# Altium schematic sheet nufsr-controller.schdoc: NUSense
size A4; Organization: Elby Designs; Address1: 9 Follan Close; Address2: Kariong; Address3: NSW 2250; Address4: Australia; Revision: 1; SheetNumber: 2; SheetTotal: 15; DrawnBy: Controller Section; Engineer: Laurie Biddulph; PageSetup: Record=PageOptions|CenterHorizontal=True|CenterVertical=True|PrintScale=1.38|XCorrection=1.00|YCorrection=1.00|PrintKind=1|BorderSize=5000000|LeftOffset=0|BottomOffset=0|Orientation=2|PaperLength=1000|PaperWidth=1000|Scale=100|PaperSource=7|PrintQuality=-4|MediaType=1|DitherType=10|PaperKind=A3|PrintScaleMode=1
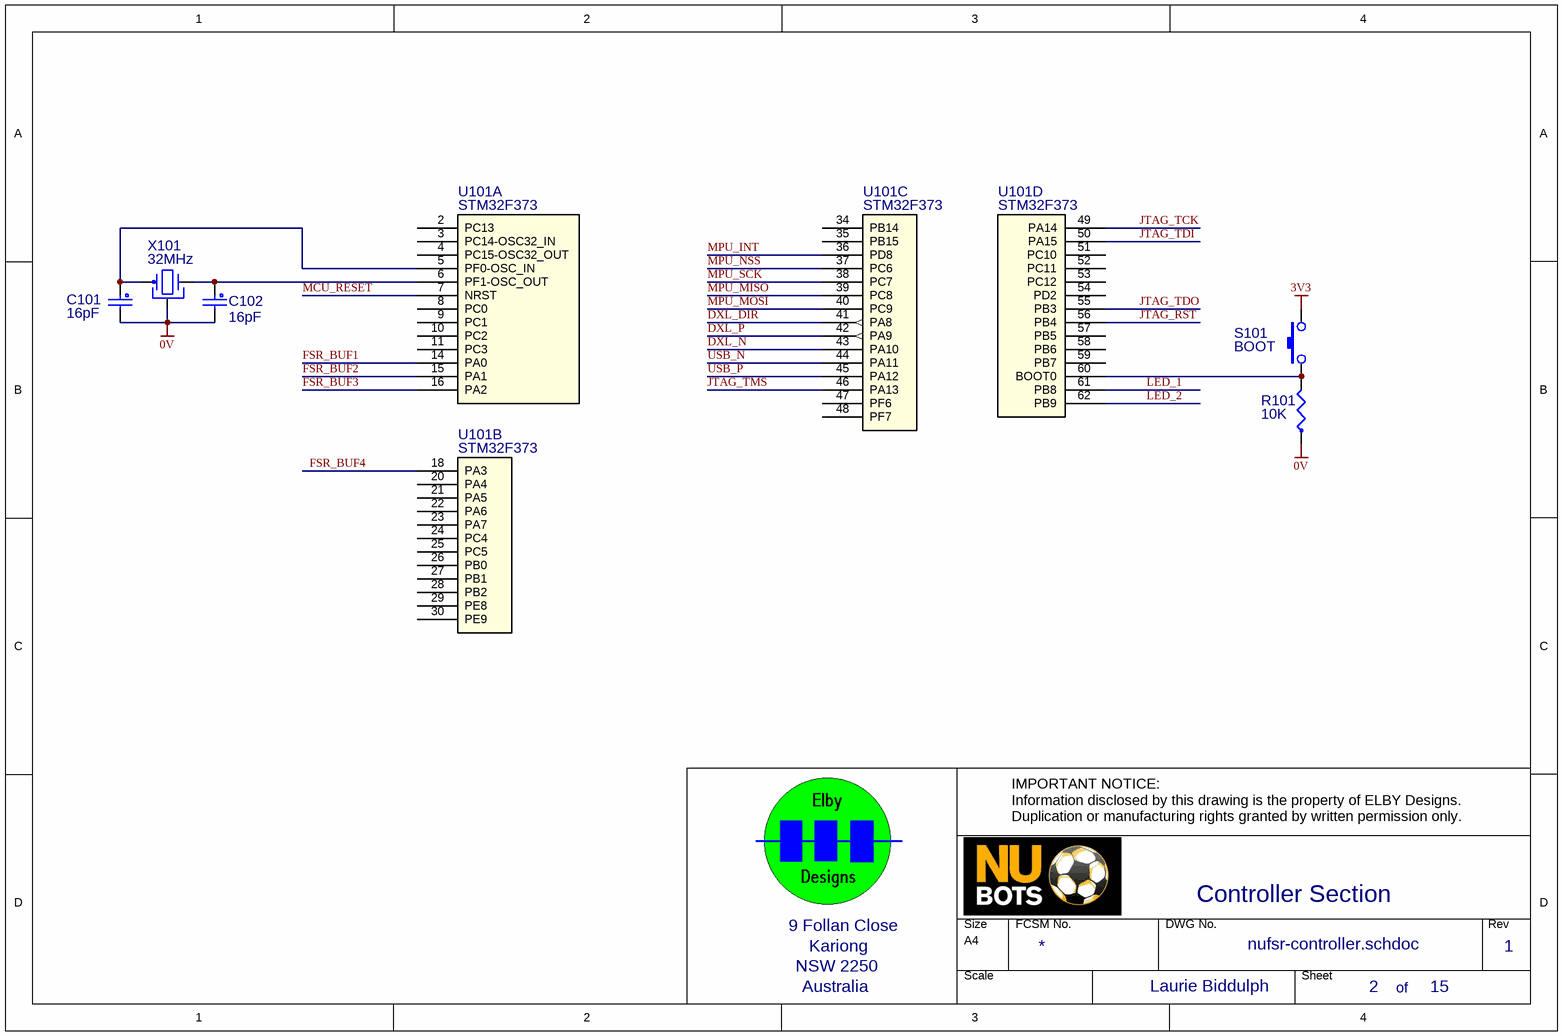
[diagram p0: nufsr-controller.schdoc]

## Parts
C101  16pF  [0805(LB)]
C102  16pF  [0805(LB)]
R101  10K  [0603(LB)]
S101  BOOT  [HDR1X2(LB)]
U101  STM32F373  [LQFP-64_10x10(LB)]  (parts A,B,C,D of 5)
X101  32MHz  [CRYSTAL-3(LB)]

## Nets
0V: C101.2 C102.2 R101.1 X101.3
3V3: S101.1(COM)
DXL_DIR: U101.41(PA8)
DXL_N: U101.43(PA10)
DXL_P: U101.42(PA9)
FSR_BUF1: U101.14(PA0)
FSR_BUF2: U101.15(PA1)
FSR_BUF3: U101.16(PA2)
FSR_BUF4: U101.18(PA3)
JTAG_RST: U101.56(PB4)
JTAG_TCK: U101.49(PA14)
JTAG_TDI: U101.50(PA15)
JTAG_TDO: U101.55(PB3)
JTAG_TMS: U101.46(PA13)
LED_1: U101.61(PB8)
LED_2: U101.62(PB9)
MCU_~{RESET}: U101.7(NRST)
MPU_INT: U101.36(PD8)
MPU_MISO: U101.39(PC8)
MPU_MOSI: U101.40(PC9)
MPU_NSS: U101.37(PC6)
MPU_SCK: U101.38(PC7)
USB_N: U101.44(PA11)
USB_P: U101.45(PA12)
NetC101_1: C101.1 U101.5(PF0-OSC_IN) X101.1
NetC102_1: C102.1 U101.6(PF1-OSC_OUT) X101.2
NetR101_2: R101.2 S101.2(NO) U101.60(BOOT0)

Not connected (* = marked no-connect by the designer): U101 2(PC13) 3(PC14-OSC32_IN) 4(PC15-OSC32_OUT) 8(PC0) 9(PC1) 10(PC2) 11(PC3) 20(PA4) 21(PA5) 22(PA6) 23(PA7) 24(PC4) 25(PC5) 26(PB0) 27(PB1) 28(PB2) 29(PE8) 30(PE9) 34(PB14) 35(PB15) 47(PF6) 48(PF7) 51(PC10) 52(PC11) 53(PC12) 54(PD2) 57(PB5) 58(PB6) 59(PB7)

## Notes on the sheet
- IMPORTANT NOTICE:
  Information disclosed by this drawing is the property of ELBY Designs.
  Duplication or manufacturing rights granted by written permission only.
- of

## Library data of the parts
C101 C102 = CC-10PF(LB): NPO Low K, 50VDC Ceramic Disc; EMRP: CC-10PF
R101 = RM-10K(LB): 0.5W 1% Metal Film Resistor; EMRP: RM-10K
S101 = SW-PB-SPST(LB): PCB Push-button Switch; Text Field2: SP-0600
U101 = STM32F373: 32-bit Microcontroller; Manufacturer_Part_Number: stm32f74xzxt; Vendor: STMicroelectronics; C: Copyright (C) 2016 Accelerated Designs. All rights reserved; Copyright: Copyright (C) 2016 Accelerated Designs. All rights reserved; Value: Value; Type: Type; RefDes: RefDes
X101 = XTAL-24MHZ(LB): 24MHz Parallel-cut Crystal - HC49; EMRP: ZT-20MHZ